# Altium schematic sheet HDMI.SchDoc: Ixora
size A3; Organization: Toradex AG; Address1: Altsagenstrasse 5; Address2: Horw; Address3: 6048; Address4: Switzerland; DocumentNumber: 13; Revision: V1.1; SheetNumber: 13; SheetTotal: 19; PageSetup: Record=PageOptions|CenterHorizontal=True|CenterVertical=True|PrintScale=0.73|XCorrection=1.00|YCorrection=1.00|PrintKind=0|BorderSize=5000000|LeftOffset=0|BottomOffset=0|Orientation=2|PaperLength=1000|PaperWidth=1000|Scale=100|PaperSource=7|PrintQuality=-4|MediaType=1|DitherType=10|PaperKind=A4|PrintScaleMode=1
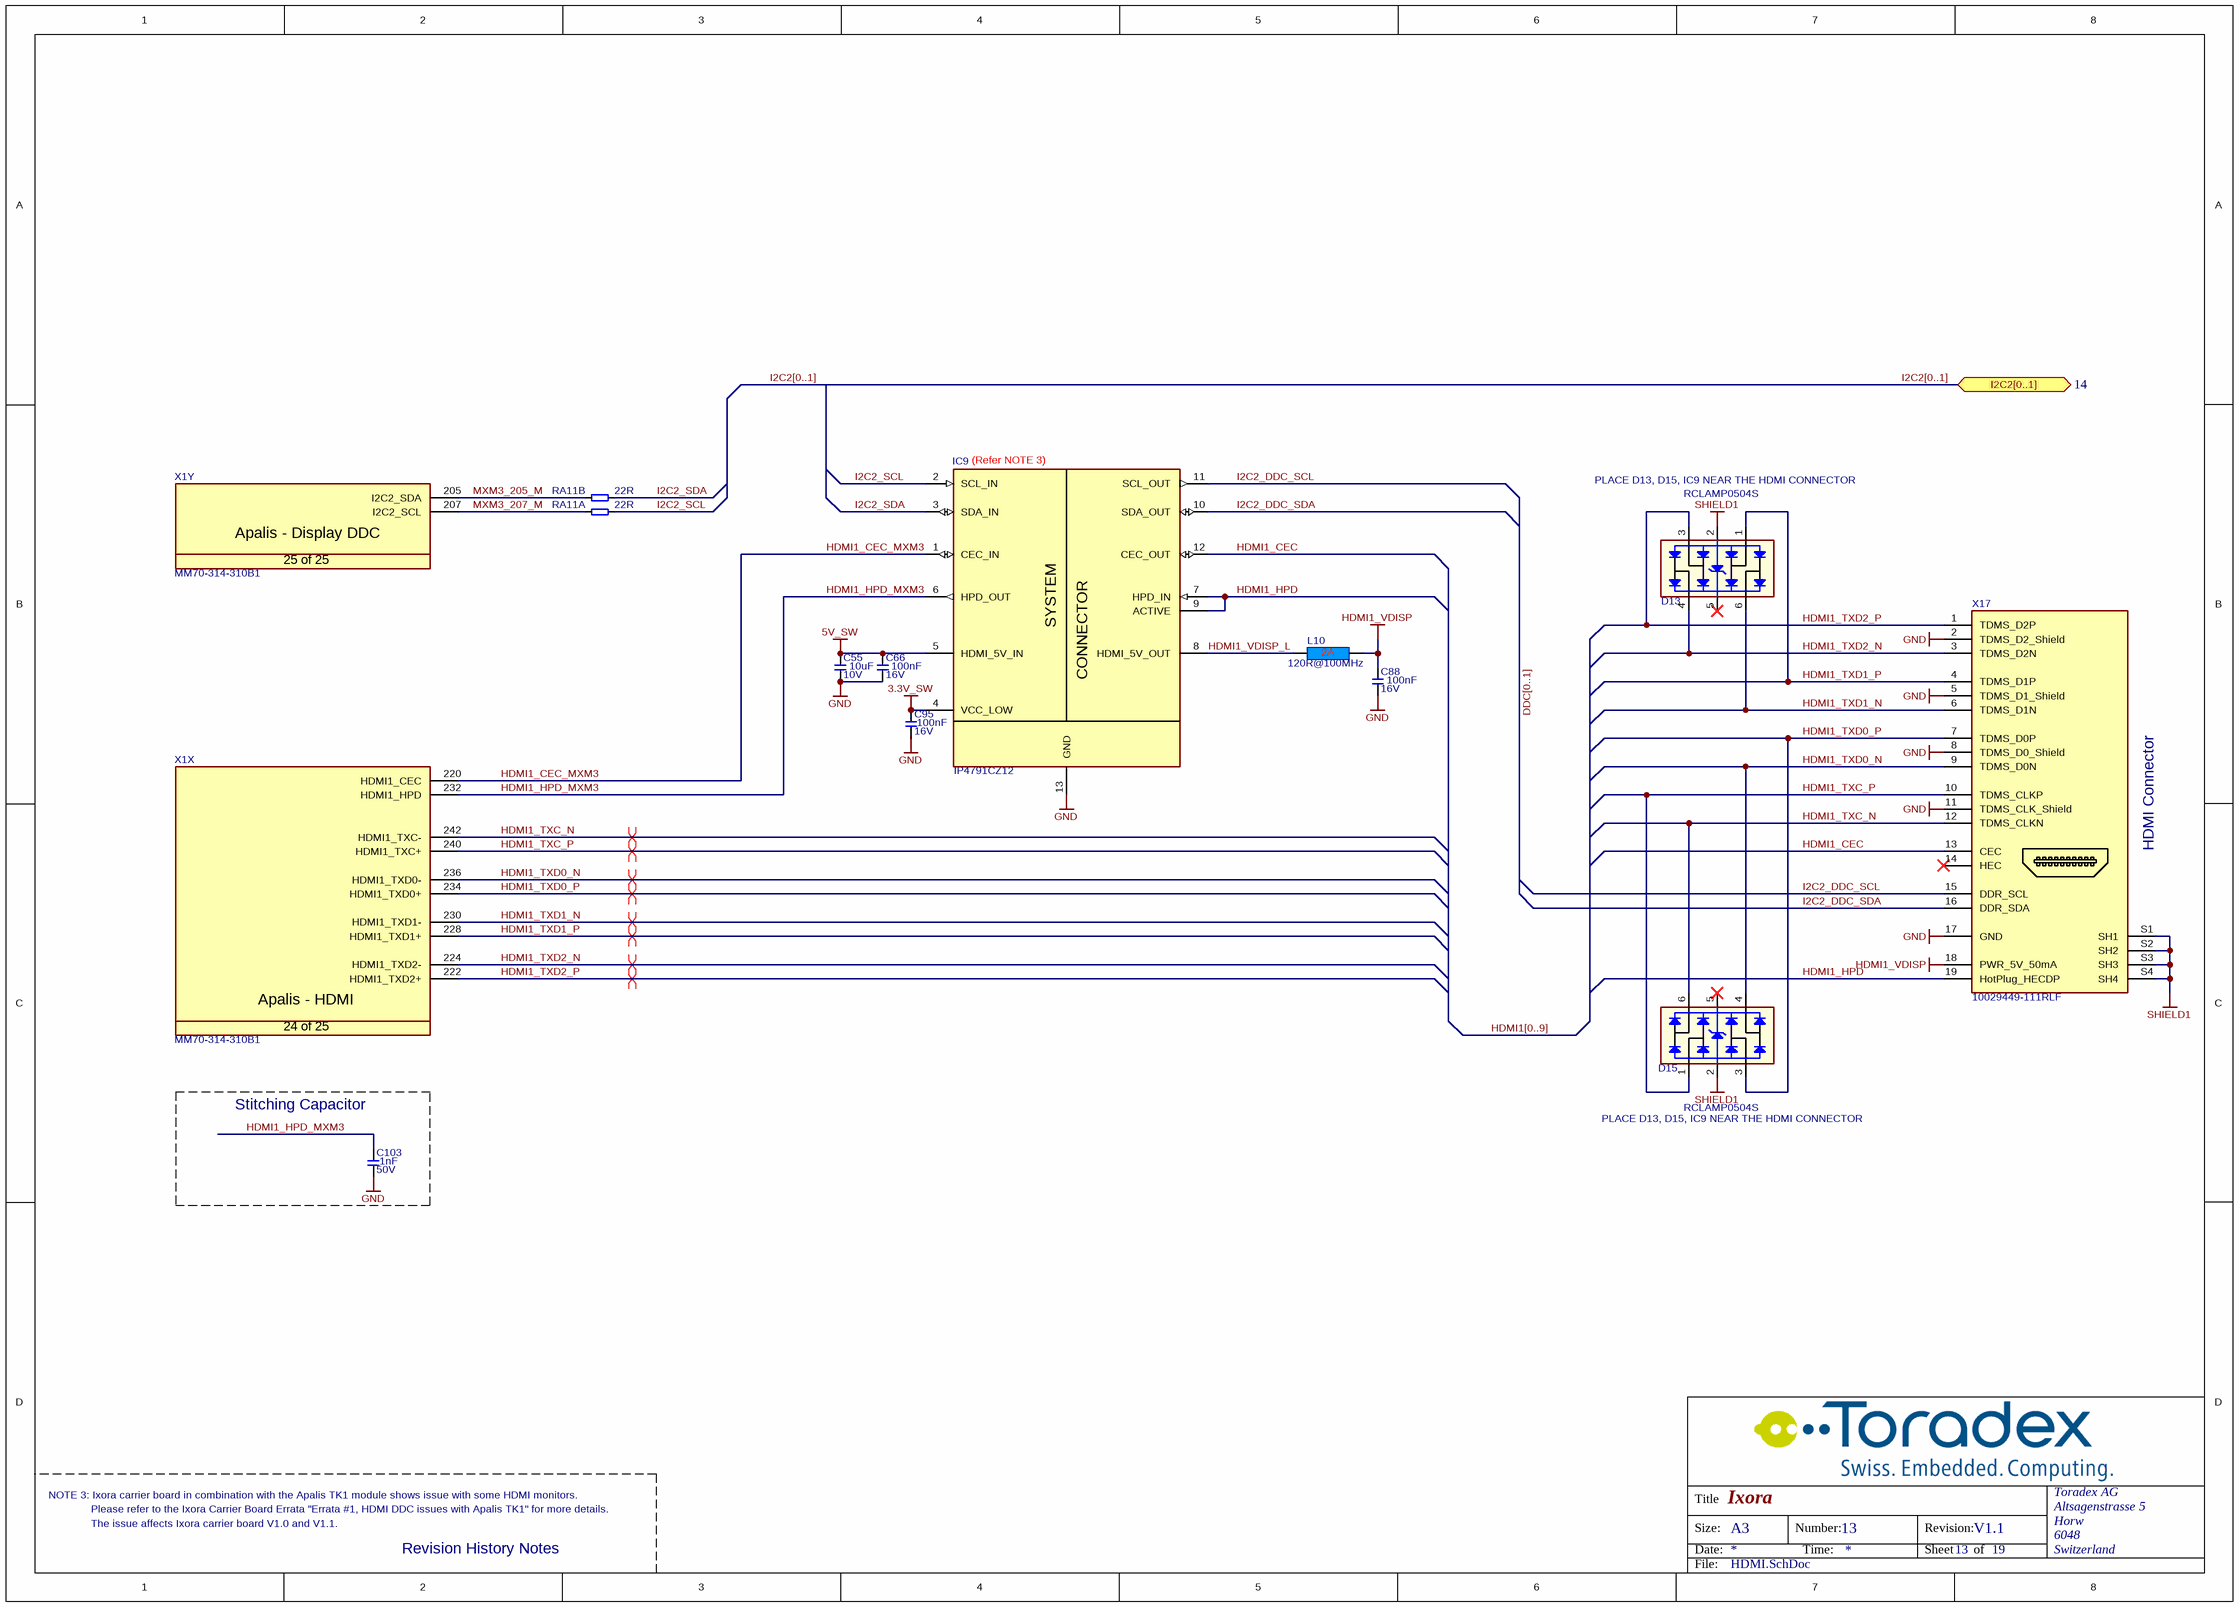
[diagram p0: HDMI.SchDoc]

## Parts
C55  Rating: 10V  [T_CAPC0603X33N]  (hidden comment: 10uF)
C66  Rating: 16V  [CAPC1005X60N]  (hidden comment: 100nF)
C88  Rating: 16V  [CAPC1005X60N]  (hidden comment: 100nF)
C95  Rating: 16V  [CAPC1005X60N]  (hidden comment: 100nF)
C103  Rating: 50V  [CAPC1005X60N]  (hidden comment: 1nF)
D13  RCLAMP0504S  [T_SOT95P285X90-6N]
D15  RCLAMP0504S  [T_SOT95P285X90-6N]
IC9  IP4791CZ12  [T_NXP_IP4791CZ12]
L10  120R@100MHz  [INDC1608X95N]
RA11  22R  [T_Resistor_Array_X4]  (parts A,B of 4)
X1  Manufacturer Part No.: MM70-314-310B1  [T_JAE_MM70-314-310B1]  (hidden comment: CON-JAE-MM70-314-310B1-314-0.5mm)  (parts X,Y of 25)
X17  10029449-111RLF  [T_FCI_10029449-111RLF]

## Blocks framed on the sheet
Stitching Capacitor: C103

## Ports
I2C2[0..1] (bidir, see 14)

## Nets
3.3V_SW: C95.2 IC9.4(VCC_LOW)
5V_SW: C55.2 C66.1 IC9.5(HDMI_5V_IN)
GND: C55.1 C66.2 C88.1 C95.1 C103.1 IC9.13(GND) X17.2(TDMS_D2_Shield) X17.5(TDMS_D1_Shield) X17.8(TDMS_D0_Shield) X17.11(TDMS_CLK_Shield) X17.17(GND)
HDMI1_VDISP: C88.2 L10.2 X17.18(PWR_5V_50mA)
SHIELD1: D13.2 D15.2 X17.S1(SH1) X17.S2(SH2) X17.S3(SH3) X17.S4(SH4)
HDMI1_CEC: IC9.12(CEC_OUT) X17.13(CEC)
HDMI1_CEC_MXM3: IC9.1(CEC_IN) X1.220(HDMI1_CEC)
HDMI1_HPD: IC9.7(HPD_IN) IC9.9(ACTIVE) X17.19(HotPlug_HECDP)
HDMI1_HPD_MXM3: C103.2 IC9.6(HPD_OUT) X1.232(HDMI1_HPD)
HDMI1_TXC_N: D15.6 X1.242(HDMI1_TXC-) X17.12(TDMS_CLKN)
HDMI1_TXC_P: D15.1 X1.240(HDMI1_TXC+) X17.10(TDMS_CLKP)
HDMI1_TXD0_N: D15.4 X1.236(HDMI1_TXD0-) X17.9(TDMS_D0N)
HDMI1_TXD0_P: D15.3 X1.234(HDMI1_TXD0+) X17.7(TDMS_D0P)
HDMI1_TXD1_N: D13.6 X1.230(HDMI1_TXD1-) X17.6(TDMS_D1N)
HDMI1_TXD1_P: D13.1 X1.228(HDMI1_TXD1+) X17.4(TDMS_D1P)
HDMI1_TXD2_N: D13.4 X1.224(HDMI1_TXD2-) X17.3(TDMS_D2N)
HDMI1_TXD2_P: D13.3 X1.222(HDMI1_TXD2+) X17.1(TDMS_D2P)
HDMI1_VDISP_L: IC9.8(HDMI_5V_OUT) L10.1
I2C2_DDC_SCL: IC9.11(SCL_OUT) X17.15(DDR_SCL)
I2C2_DDC_SDA: IC9.10(SDA_OUT) X17.16(DDR_SDA)
I2C2_SCL: IC9.2(SCL_IN) RA11.5
I2C2_SDA: IC9.3(SDA_IN) RA11.6
MXM3_205_M: RA11.2 X1.205(I2C2_SDA)
MXM3_207_M: RA11.1 X1.207(I2C2_SCL)

Not connected (* = marked no-connect by the designer): D13 5*; D15 5*; X17 14(HEC)*

## Buses and harness runs
bus DDC[0..1]
bus HDMI1[0..9]
bus I2C2[0..1] = port I2C2[0..1]

## Layout directives
differential pair: HDMI1_TXC_N, HDMI1_TXC_P, HDMI1_TXD0_N, HDMI1_TXD0_P, HDMI1_TXD1_N, HDMI1_TXD1_P, HDMI1_TXD2_N, HDMI1_TXD2_P

## Notes on the sheet
- (near IC9) (Refer NOTE 3)
- (near D13) PLACE D13, D15, IC9 NEAR THE HDMI CONNECTOR
- (near X17) HDMI Connector
- (near D15) PLACE D13, D15, IC9 NEAR THE HDMI CONNECTOR
- NOTE 3: Ixora carrier board in combination with the Apalis TK1 module shows issue with some HDMI monitors.
- Please refer to the Ixora Carrier Board Errata "Errata #1, HDMI DDC issues with Apalis TK1" for more details.
- The issue affects Ixora carrier board V1.0 and V1.1.
- Revision History Notes
- Title
- Size:
- Date:
- A3
- Number:
- Time:
- Revision:
- Sheet
- of
- File:
- (in symbol CON-JAE-MM70-314-310B1-314-0.5mm, part X) Apalis - HDMI; 24 of 25
- (in symbol CON-JAE-MM70-314-310B1-314-0.5mm, part Y) Apalis - Display DDC; 25 of 25
- (in symbol IC-NXP-IP4791CZ12) SYSTEM; CONNECTOR

## Library data of the parts
C55 = C-X5R-10uF-10V-20%-0603: Capacitor Ceramic X5R 10uF 10V 20% 0603; Tolerance: 20%; Type: X5R; Value: 10uF
C66 C88 C95 = C-X7R-100nF-16V-10%-0402: Capacitor Ceramic X7R 100nF 16V 10% 0402; Tolerance: 10%; Type: X7R; Value: 100nF
C103 = C-X7R-1nF-50V-10%-0402: Capacitor Ceramic X7R 1nF 50V 10% 0402; Tolerance: 10%; Type: X7R; Value: 1nF
D13 D15 = D-Semtech-RClamp0504S: TVS Array low cap; Manufacturer Name: Semtech; Manufacturer Part No.: RCLAMP0504S
IC9 = IC-NXP-IP4791CZ12: HDMI ESD protection, level shifter and backdrive protection; Manufacturer Name: NXP; Manufacturer Part No.: IP4791CZ12
L10 = L-120R@100MHz-2A-25%-0603: 120R@100MHz 2A EMI FILTER; Tolerance: 25%; Rating: 2A; Value: 120R@100MHz
RA11 = RA-22R-63mW-5%-1206-div: Resistor Array 22 R 63mW 5% 1206; Tolerance: 5%; Power Dissipation: 63mW; Value: 22R
X1 = CON-JAE-MM70-314-310B1-314-0.5mm: MXM3 Connector; Manufacturer Name: JAE; No. of ways: 314
X17 = CON-FCI-10029449-111RLF: HDMI Connector Right Angle Vertical THT; Manufacturer: FCI; Manufacturer Part No.: 10029449-111RLF